# EAGLE design BatteryBoard (EAGLE 9.6.2)
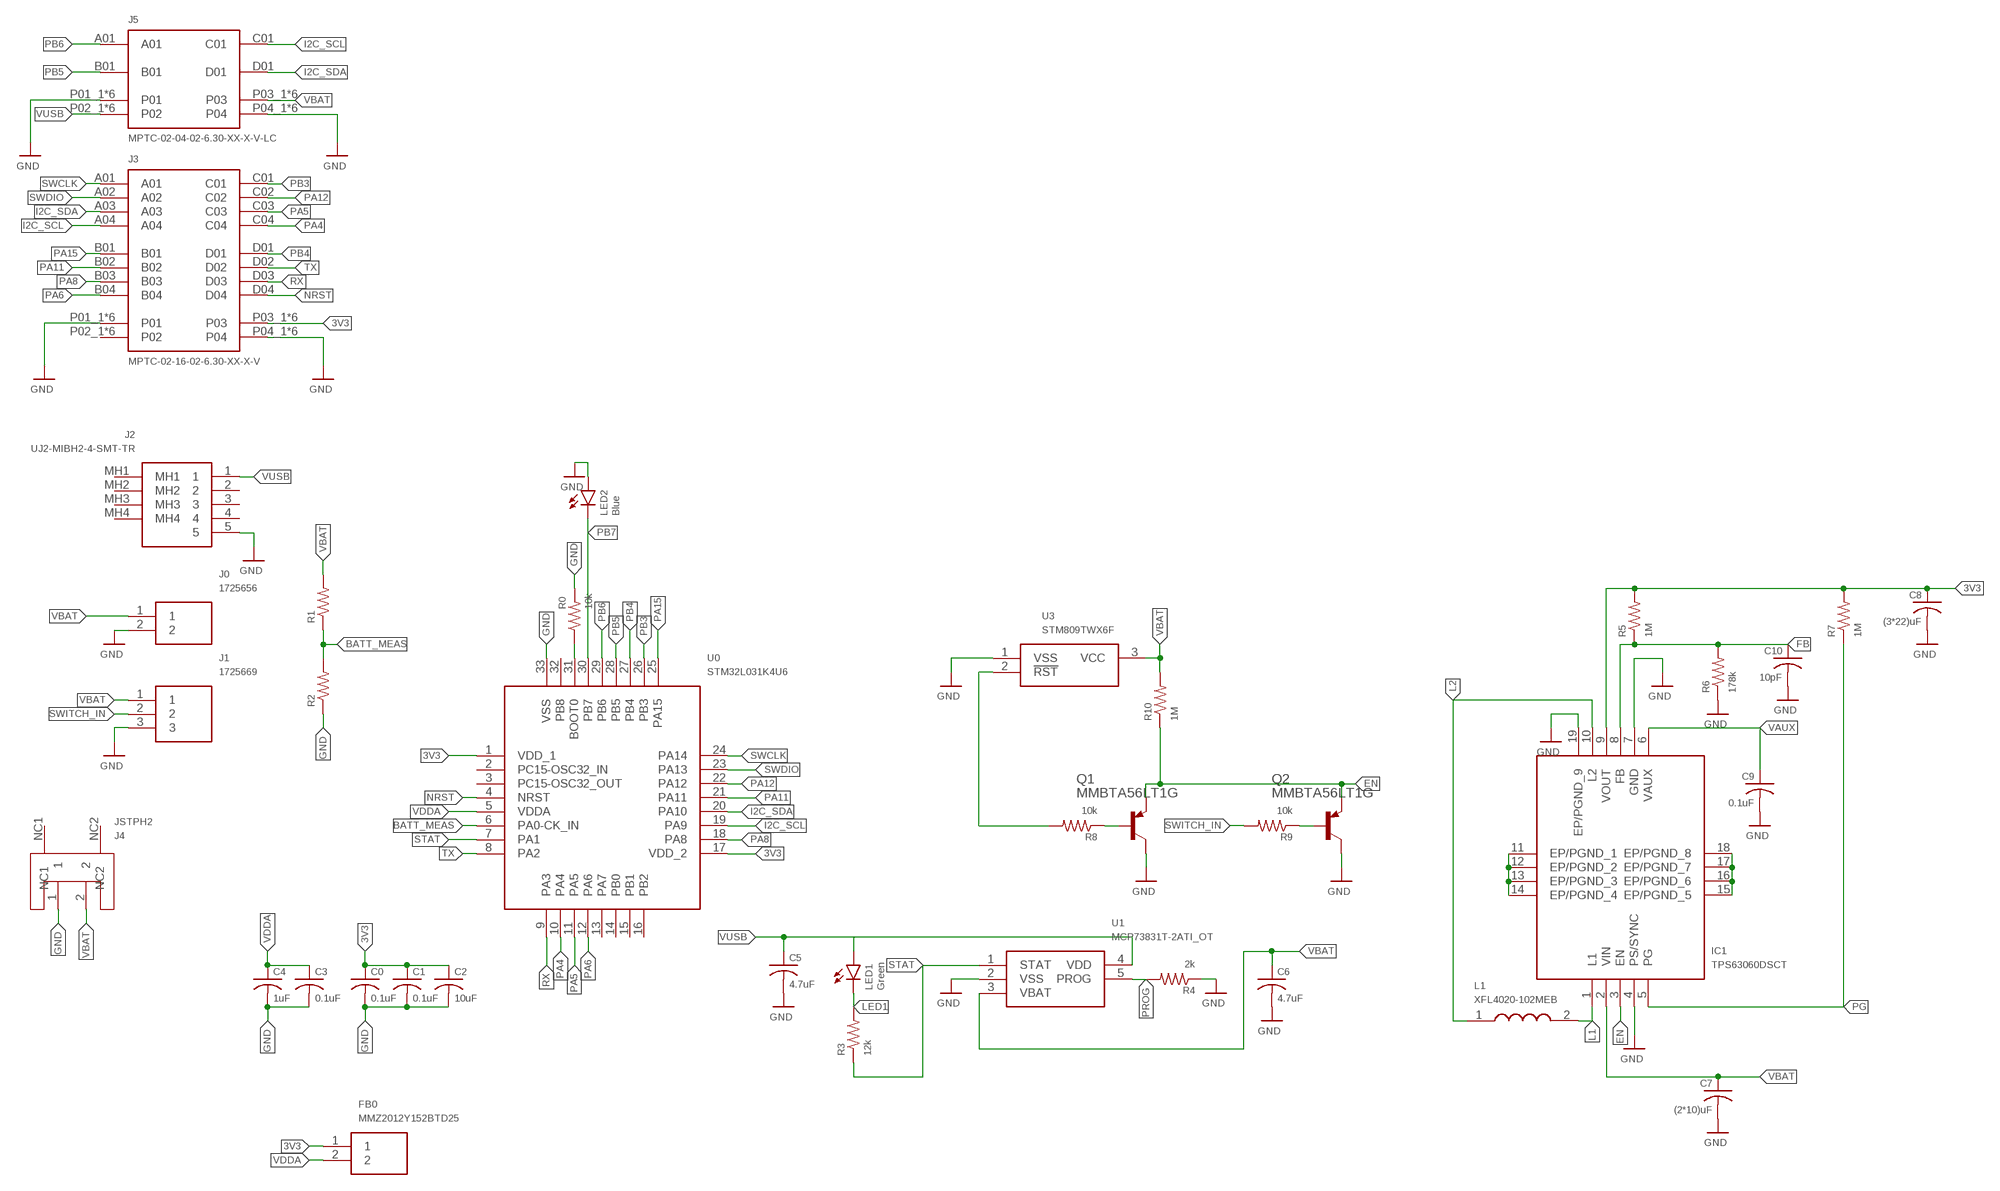
[diagram p0: schematic, sheet 1]

## Parts
C0  0.1uF  C-USC0805  [C0805]
C1  0.1uF  C-USC0805  [C0805]
C2  10uF  C-USC0805  [C0805]
C3  0.1uF  C-USC0805  [C0805]
C4  1uF  C-USC0805  [C0805]
C5  4.7uF  C-USC0805  [C0805]
C6  4.7uF  C-USC0805  [C0805]
C7  (2*10)uF  C-USC0805  [C0805]
C8  (3*22)uF  C-USC0805  [C0805]
C9  0.1uF  C-USC0805  [C0805]
C10  10pF  C-USC0805  [C0805]
FB0  MMZ2012Y152BTD25  [BEADC2012X105N]
IC1  TPS63060DSCT  [TPS63060DSCT]
J0  1725656  [1725656]
J1  1725669  [1725669]
J2  UJ2-MIBH2-4-SMT-TR  [UJ2MIBH24SMTTR]
J3  MPTC-02-16-02-6.30-XX-X-V  [SAMTEC_MPTC-02-16-02-6.30-XX-X-V]
J4  JSTPH2  [JSTPH2]
J5  MPTC-02-04-02-6.30-XX-X-V-LC  [SAMTEC_MPTC-02-04-02-6.30-XX-X-V-LC]
L1  XFL4020-102MEB  [XFL4020102MEB]
LED1  Green  LEDCHIP-LED0805  [CHIP-LED0805]
LED2  Blue  LEDCHIP-LED0805  [CHIP-LED0805]
Q1  MMBTA56LT1G  BC807-16-PNP-SOT23-BEC  [SOT23-BEC]
Q2  MMBTA56LT1G  BC807-16-PNP-SOT23-BEC  [SOT23-BEC]
R0  10k  R-US_R0805  [R0805]
R1  R-US_R0805  [R0805]
R2  R-US_R0805  [R0805]
R3  12k  R-US_R0805  [R0805]
R4  2k  R-US_R0805  [R0805]
R5  1M  R-US_R0805  [R0805]
R6  178k  R-US_R0805  [R0805]
R7  1M  R-US_R0805  [R0805]
R8  10k  R-US_R0805  [R0805]
R9  10k  R-US_R0805  [R0805]
R10  1M  R-US_R0805  [R0805]
U0  STM32L031K4U6  [QFN50P500X500X60-33N]
U1  MCP73831T-2ATI_OT  [SOT95P270X145-5N]
U3  STM809TWX6F  [SOT103P237X112-3N]

## Nets
3V3: C0.1 C1.1 C2.1 C8.1 FB0.1 IC1.9(VOUT) J3.P03_1(P03) J3.P03_2(P03) J3.P03_3(P03) J3.P03_4(P03) J3.P03_5(P03) J3.P03_6(P03) R5.2 R7.2 U0.1(VDD_1) U0.17(VDD_2)
BATT_MEAS: R1.1 R2.2 U0.6(PA0-CK_IN)
BOOT0: R0.1 U0.31(BOOT0)
EN: IC1.3(EN) Q1.E Q2.E R10.1
FB: C10.1 IC1.8(FB) R5.1 R6.2
GND: C0.2 C1.2 C2.2 C3.2 C4.2 C5.2 C6.2 C7.2 C8.2 C9.2 C10.2 IC1.4(PS/SYNC) IC1.7(GND) IC1.11(EP/PGND_1) IC1.12(EP/PGND_2) IC1.13(EP/PGND_3) IC1.14(EP/PGND_4) IC1.15(EP/PGND_5) IC1.16(EP/PGND_6) IC1.17(EP/PGND_7) IC1.18(EP/PGND_8) IC1.19(EP/PGND_9) J0.2 J1.3 J2.5 J3.P01_1(P01) J3.P01_2(P01) J3.P01_3(P01) J3.P01_4(P01) J3.P01_5(P01) J3.P01_6(P01) J3.P04_1(P04) J3.P04_2(P04) J3.P04_3(P04) J3.P04_4(P04) J3.P04_5(P04) J3.P04_6(P04) J4.1 J5.P01_1(P01) J5.P01_2(P01) J5.P01_3(P01) J5.P01_4(P01) J5.P01_5(P01) J5.P01_6(P01) J5.P04_1(P04) J5.P04_2(P04) J5.P04_3(P04) J5.P04_4(P04) J5.P04_5(P04) J5.P04_6(P04) LED2.A Q1.C Q2.C R0.2 R2.1 R4.1 R6.1 U0.33(VSS) U1.2(VSS) U3.1(VSS)
I2C_SCL: J3.A04 J5.C01 U0.19(PA9)
I2C_SDA: J3.A03 J5.D01 U0.20(PA10)
L1: IC1.1(L1) L1.2
L2: IC1.10(L2) L1.1
LED1: LED1.C R3.2
N$2: Q1.B R8.1
N$4: Q2.B R9.1
NRST: J3.D04 U0.4(NRST)
PA4: J3.C04 U0.10(PA4)
PA5: J3.C03 U0.11(PA5)
PA6: J3.B04 U0.12(PA6)
PA8: J3.B03 U0.18(PA8)
PA11: J3.B02 U0.21(PA11)
PA12: J3.C02 U0.22(PA12)
PA15: J3.B01 U0.25(PA15)
PB3: J3.C01 U0.26(PB3)
PB4: J3.D01 U0.27(PB4)
PB5: J5.B01 U0.28(PB5)
PB6: J5.A01 U0.29(PB6)
PB7: LED2.C U0.30(PB7)
PG: IC1.5(PG) R7.1
PROG: R4.2 U1.5(PROG)
PROTECTION_NRST: R8.2 U3.2(!RST)
RX: J3.D03 U0.9(PA3)
STAT: R3.1 U0.7(PA1) U1.1(STAT)
SWCLK: J3.A01 U0.24(PA14)
SWDIO: J3.A02 U0.23(PA13)
SWITCH_IN: J1.2 R9.2
TX: J3.D02 U0.8(PA2)
VAUX: C9.1 IC1.6(VAUX)
VBAT: C6.1 C7.1 IC1.2(VIN) J0.1 J1.1 J4.2 J5.P03_1(P03) J5.P03_2(P03) J5.P03_3(P03) J5.P03_4(P03) J5.P03_5(P03) J5.P03_6(P03) R1.2 R10.2 U1.3(VBAT) U3.3(VCC)
VDDA: C3.1 C4.1 FB0.2 U0.5(VDDA)
VUSB: C5.1 J2.1 J5.P02_1(P02) J5.P02_2(P02) J5.P02_3(P02) J5.P02_4(P02) J5.P02_5(P02) J5.P02_6(P02) LED1.A U1.4(VDD)
Unconnected: J2.2 J2.3 J2.4 J2.MH1 J2.MH2 J2.MH3 J2.MH4 J4.NC1 J4.NC2 U0.2(PC15-OSC32_IN) U0.3(PC15-OSC32_OUT) U0.13(PA7) U0.14(PB0) U0.15(PB1) U0.16(PB2) U0.32(PB8)

## Power pins joined to a net without a drawn wire
P02: J3.P02_1(P02) J3.P02_2(P02) J3.P02_3(P02) J3.P02_4(P02) J3.P02_5(P02) J3.P02_6(P02)

## Library data of the parts
C0 C1-C10 = rcl:C-US: CAPACITOR, American symbol; SPICEPREFIX: C
FB0 = SamacSys_Parts:MMZ2012Y152BTD25: Ferrite Beads 0805 1500ohms 500mA Signal Line AEC-Q200 Source: Datasheet <https://product.tdk.com/info/en/catalog/datasheets/beads_automotive_signal_mmz2012_en.pdf>; DESCRIPTION: Ferrite Beads 0805 1500ohms 500mA Signal Line AEC-Q200; HEIGHT: 1.05mm; MANUFACTURER_NAME: TDK; MANUFACTURER_PART_NUMBER: MMZ2012Y152BTD25; MOUSER_PART_NUMBER: 810-MMZ2012Y152BTD25; MOUSER_PRICE-STOCK: https://www.mouser.co.uk/ProductDetail/TDK/MMZ2012Y152BTD25/?qs=z4cHi%252BdwYubbRRUCER1uug%3D%3D
IC1 = SamacSys_Parts:TPS63060DSCT: Switching Voltage Regulators 2.5-12Vin,2.25A Sw Crnt Limit Source: Datasheet <https://www.ti.com/lit/ds/symlink/tps63060.pdf?ts=1601363493602&ref_url=https%3A%2F%2Fwww.ti.com%2Fproduct%2FTPS63060>; DESCRIPTION: Switching Voltage Regulators 2.5-12Vin,2.25A Sw Crnt Limit; HEIGHT: 0.8mm; MANUFACTURER_NAME: Texas Instruments; MANUFACTURER_PART_NUMBER: TPS63060DSCT; MOUSER_PART_NUMBER: 595-TPS63060DSCT; MOUSER_PRICE-STOCK: https://www.mouser.co.uk/ProductDetail/Texas-Instruments/TPS63060DSCT/?qs=3jfYfyvUSwDkzbf98IOP5g%3D%3D
J0 = SamacSys_Parts:1725656: 2 way PCB vertical mount terminal,2.54mm 2 way PCB vertical mount terminal,2.54mm Source: Datasheet <https://www.phoenixcontact.com/online/portal/gb?uri=pxc-oc-itemdetail:pid=1725656&library=gben&tab=1>; DESCRIPTION: 2 way PCB vertical mount terminal,2.54mm 2 way PCB vertical mount terminal,2.54mm; HEIGHT: 8mm; MANUFACTURER_NAME: Phoenix Contact; MANUFACTURER_PART_NUMBER: 1725656; MOUSER_PART_NUMBER: 651-1725656; MOUSER_PRICE-STOCK: https://www.mouser.co.uk/ProductDetail/Phoenix-Contact/1725656/?qs=Ul7CXFMnlWWQeccayYbRmw%3D%3D
J1 = SamacSys_Parts:1725669: 3 way PCB vertical mount terminal,2.54mm 3 way PCB vertical mount terminal,2.54mm Source: Datasheet <https://www.phoenixcontact.com/online/portal/gb?uri=pxc-oc-itemdetail:pid=1725669&library=gben&tab=1>; DESCRIPTION: 3 way PCB vertical mount terminal,2.54mm 3 way PCB vertical mount terminal,2.54mm; HEIGHT: 8.5mm; MANUFACTURER_NAME: Phoenix Contact; MANUFACTURER_PART_NUMBER: 1725669; MOUSER_PART_NUMBER: 651-1725669; MOUSER_PRICE-STOCK: https://www.mouser.co.uk/ProductDetail/Phoenix-Contact/1725669/?qs=A%2FKWGUWTCZjmkTL0Oe91ew%3D%3D
J2 = SamacSys_Parts:UJ2-MIBH2-4-SMT-TR: CONN RCPT USB2.0 MICRO B SMD R/A Source: Datasheet <https://www.cui.com/product/resource/digikeypdf/uj2-mibh2-4-smt.pdf>; DESCRIPTION: CONN RCPT USB2.0 MICRO B SMD R/A; HEIGHT: 2.5mm; MANUFACTURER_NAME: CUI Inc.; MANUFACTURER_PART_NUMBER: UJ2-MIBH2-4-SMT-TR; MOUSER_PART_NUMBER: 490-UJ2-MIBH2-4-SMT; MOUSER_PRICE-STOCK: https://www.mouser.co.uk/ProductDetail/CUI-Devices/UJ2-MIBH2-4-SMT-TR/?qs=5mqXD9RfOg1yxHIpPvPxvQ%3D%3D
J3 = MPTC-02-16-02-6.30-XX-X-V:MPTC-02-16-02-6.30-XX-X-V: 30 A SIGNAL/POWER COMBO SYSTEM; MANUFACTURER: Samtec; MAXIMUM_PACKAGE_HEIGHT: 11.38 mm; PARTREV: L; STANDARD: Manufacturer Recommendations
J4 = Connect:JSTPH2
J5 = MPTC-02-04-02-6.30-XX-X-V-LC:MPTC-02-04-02-6.30-XX-X-V-LC: DC Power Connectors; MANUFACTURER: Samtec; MAXIMUM_PACKAGE_HEIGHT: 11.38 mm; PARTREV: L; STANDARD: Manufacturer Recommendations
L1 = SamacSys_Parts:XFL4020-102MEB: 1 ELEMENT, 1 uH, METAL COMPOSITE-CORE, GENERAL PURPOSE INDUCTOR, SMD Source: Datasheet <https://www.coilcraft.com/getmedia/50632d43-da1b-4cdb-8ab4-3029cab51df3/xfl4020.pdf>; DESCRIPTION: 1 ELEMENT, 1 uH, METAL COMPOSITE-CORE, GENERAL PURPOSE INDUCTOR, SMD; HEIGHT: 2.1mm; MANUFACTURER_NAME: COILCRAFT; MANUFACTURER_PART_NUMBER: XFL4020-102MEB; MOUSER_PART_NUMBER: 994-XFL4020-102MEB; MOUSER_PRICE-STOCK: https://www.mouser.co.uk/ProductDetail/Coilcraft/XFL4020-102MEB/?qs=VJjuEbE9QBMkuCkoKl%252B%2FQw%3D%3D
LED1 LED2 = led:LED: LED OSRAM: - CHIPLED LG R971, LG N971, LY N971, LG Q971, LY Q971, LO R971, LY R971 LH N974, LH R974 LS Q976, LO Q976, LY Q976 LO Q996 - Hyper CHIPLED LW Q18S LB Q993, LB Q99A, LB R99A - SideLED LS A670, LO A670, LY A670, LG A670, LP A670 LB A673, LV A673, LT A673, LW A673 LH A674 LY A675 LS A676, LA A676, LO A676, LY A676, LW A676 LS A679, LY A679, LG A679 - Hyper Micro SIDELED® LS Y876, LA Y876, LO Y876, LY Y876 LT Y87S - SmartLED LW L88C, LW L88S LB L89C, LB L89S, LG L890 LS L89K, LO L89K, LY L89K LS L896, LA L896, LO L896, LY L896 - TOPLED LS T670, LO T670, LY T670, LG T670, LP T670 LSG T670, LSP T670, LSY T670, LOP T670, LYG T670 LG T671, LOG T671, LSG T671 LB T673, LV T673, LT T673, LW T673 LH T674 LS T676, LA T676, LO T676, LY T676, LB T676, LH T676, LSB T676, LW T676 LB T67C, LV T67C, LT T67C, LS T67K, LO T67K, LY T67K, LW E67C LS E67B, LA E67B, LO E67B, LY E67B, LB E67C, LV E67C, LT E67C LW T67C LS T679, LY T679, LG T679 LS T770, LO T770, LY T770, LG T770, LP T770 LB T773, LV T773, LT T773, LW T773 LH T774 LS E675, LA E675, LY E675, LS T675 LS T776, LA T776, LO T776, LY T776, LB T776 LHGB T686 LT T68C, LB T68C - Hyper Mini TOPLED® LB M676 - Mini TOPLED Santana® LG M470 LS M47K, LO M47K, LY M47K Source: http://www.osram.convergy.de LUXEON: - LUMILED® LXK2-PW12-R00, LXK2-PW12-S00, LXK2-PW14-U00, LXK2-PW14-V00 LXK2-PM12-R00, LXK2-PM12-S00, LXK2-PM14-U00 LXK2-PE12-Q00, LXK2-PE12-R00, LXK2-PE12-S00, LXK2-PE14-T00, LXK2-PE14-U00 LXK2-PB12-K00, LXK2-PB12-L00, LXK2-PB12-M00, LXK2-PB14-N00, LXK2-PB14-P00, LXK2-PB14-Q00 LXK2-PR12-L00, LXK2-PR12-M00, LXK2-PR14-Q00, LXK2-PR14-R00 LXK2-PD12-Q00, LXK2-PD12-R00, LXK2-PD12-S00 LXK2-PH12-R00, LXK2-PH12-S00 LXK2-PL12-P00, LXK2-PL12-Q00, LXK2-PL12-R00 Source: www.luxeon.com KINGBRIGHT: KA-3528ASYC Source: www.kingbright.com
Q1 Q2 = transistor:*-PNP-: PNP Transistror
R0 R1-R10 = rcl:R-US_: RESISTOR, American symbol; SPICEPREFIX: R
U0 = SamacSys_Parts:STM32L031K4U6: ARM Microcontrollers - MCU 16/32-BITS MICROS Source: Datasheet <https://componentsearchengine.com/Datasheets/1/STM32L031K4U6.pdf>; DESCRIPTION: ARM Microcontrollers - MCU 16/32-BITS MICROS; HEIGHT: 0.6mm; MANUFACTURER_NAME: STMicroelectronics; MANUFACTURER_PART_NUMBER: STM32L031K4U6; MOUSER_PART_NUMBER: 511-STM32L031K4U6; MOUSER_PRICE-STOCK: https://www.mouser.com/Search/Refine.aspx?Keyword=511-STM32L031K4U6
U1 = SamacSys_Parts:MCP73831T-2ATI_OT: Microchip MCP73831T-2ATI/OT, Battery Charge Controller Lithium-Ion/Polymer, 500mA, 5-pin SOT-23 Source: Datasheet; DESCRIPTION: Microchip MCP73831T-2ATI/OT, Battery Charge Controller Lithium-Ion/Polymer, 500mA, 5-pin SOT-23; HEIGHT: 1.45mm; MANUFACTURER_NAME: Microchip; MANUFACTURER_PART_NUMBER: MCP73831T-2ATI/OT; MOUSER_PART_NUMBER: 579-MCP73831T-2ATIOT; MOUSER_PRICE-STOCK: https://www.mouser.co.uk/ProductDetail/Microchip-Technology/MCP73831T-2ATI-OT?qs=yUQqVecv4qsZbioEUu%252B83g%3D%3D
U3 = SamacSys_Parts:STM809TWX6F: STM809TWX6F, Processor Supervisor 3 V, 3.3 V, 5 V Active Low, Push-Pull, 3-Pin SOT-23 Source: Datasheet <http://www.st.com/web/en/resource/technical/document/datasheet/CD00003591.pdf>; DESCRIPTION: STM809TWX6F, Processor Supervisor 3 V, 3.3 V, 5 V Active Low, Push-Pull, 3-Pin SOT-23; HEIGHT: 1.12mm; MANUFACTURER_NAME: STMicroelectronics; MANUFACTURER_PART_NUMBER: STM809TWX6F; MOUSER_PART_NUMBER: 511-STM809TWX6F; MOUSER_PRICE-STOCK: https://www.mouser.co.uk/ProductDetail/STMicroelectronics/STM809TWX6F?qs=sps7W%2FwBcGF1WRYECktBGw%3D%3D

## Board
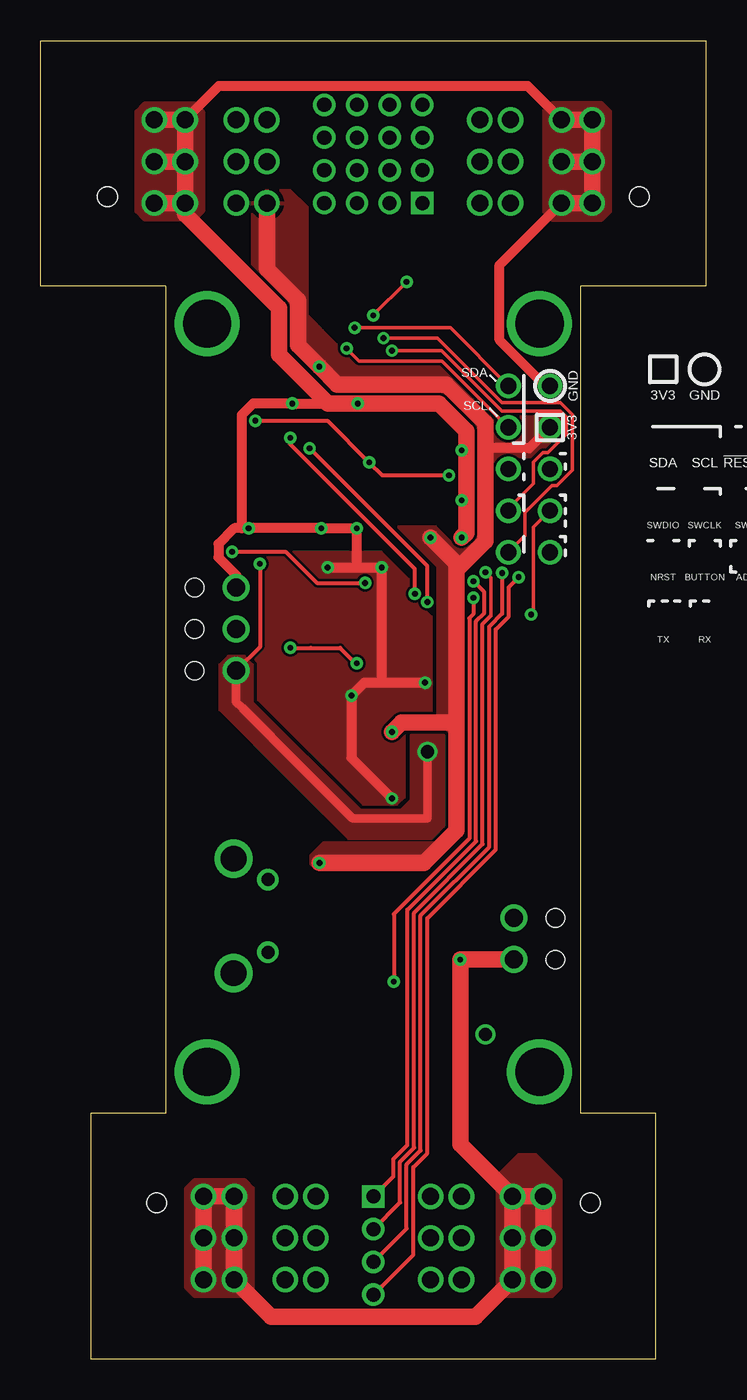
[diagram p1: board, top side]
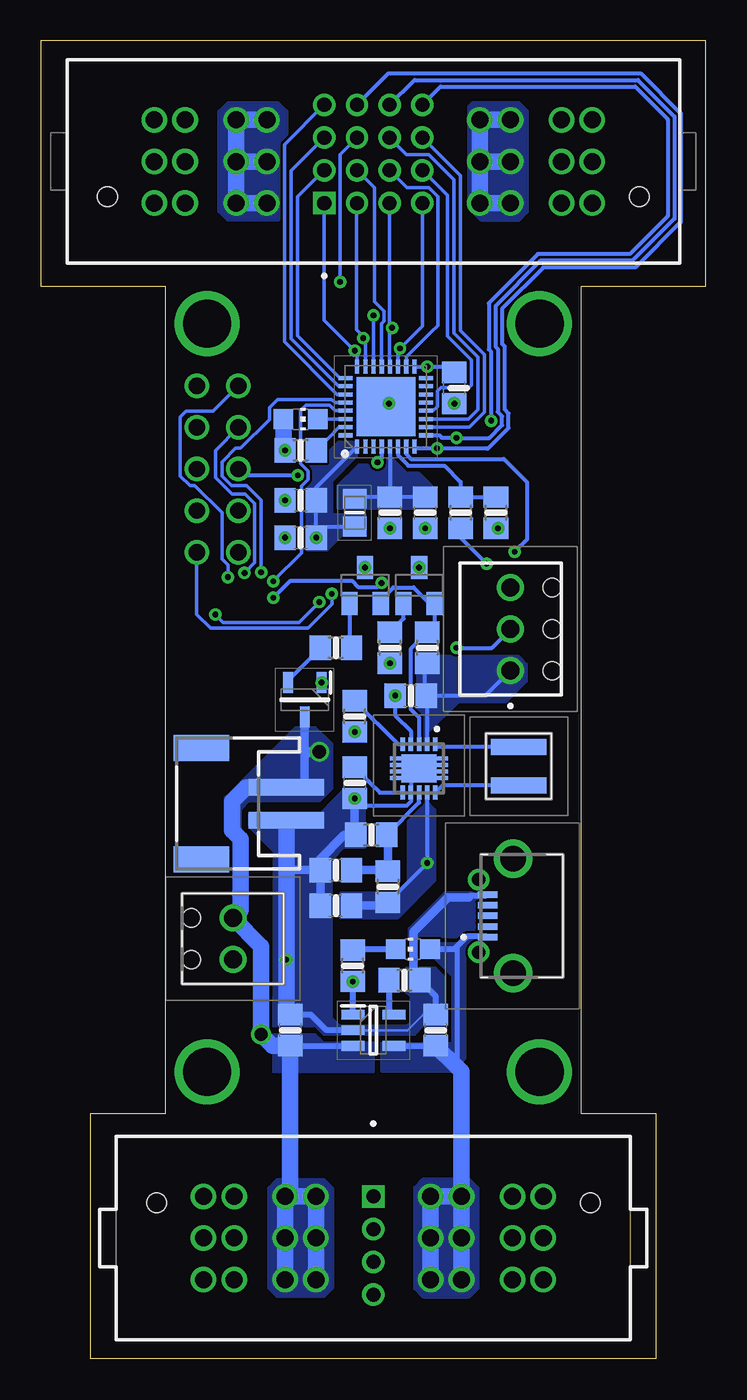
[diagram p2: board, bottom side, seen from below]

Size 40.64 x 80.52 mm. Coordinates in mm from the lower left corner, seen from the top.
Outline: 33.02,14.99 33.02,65.53 40.64,65.53 40.64,80.52 0,80.52 0,65.53 7.62,65.53 7.62,14.99 3.05,14.99 3.05,0 37.59,0 37.59,14.99 33.02,14.99
Copper layers (1*16): Top 0.035mm / dielectric 1.5mm / Bottom 0.035mm
Design rules "default *": minimum track width 6mil, minimum drill 0.35mm, track to track 6mil, track to pad 6mil, pad to pad 6mil, via to via 6mil, smd to smd 6mil, copper to edge 10mil, drill to drill 5mil, minimum pad ring 10mil, minimum via ring 8mil, stop-mask expansion 4mil, vias tented up to drill 0mil, thermal gap 10mil

### Footprints (pad centres in the part's own frame; a part is rotated, then mirrored left to right if it is on the bottom)
C0805 = smd 1.3 x 1.5: 1 -0.95,0; 2 0.95,0
BEADC2012X105N = smd 1.2 x 1.45: 1 -0.85,0; 2 0.85,0
TPS63060DSCT = smd 0.28 x 0.85: 1 -1,-1.475; 2 -0.5,-1.475; 3 0,-1.475; 4 0.5,-1.475; 5 1,-1.475; 6 1,1.475; 7 0.5,1.475; 8 0,1.475; 9 -0.5,1.475; 10 -1,1.475 | smd 0.7 x 0.25: 11 -1.425,0.6; 12 -1.425,0.2; 13 -1.425,-0.2; 14 -1.425,-0.6; 15 1.425,-0.6; 16 1.425,-0.2; 17 1.425,0.2; 18 1.425,0.6 | smd 2.15 x 1.7: 19 0,0
1725656 = drill 1.1 pad 1.65: 1 -1.27,3.1; 2 1.27,3.1 | hole 1.1: -1.27,0.56; 1.27,0.56
1725669 = drill 1.1 pad 1.65: 1 0,0; 2 2.54,0; 3 5.08,0 | hole 1.1: 0,-2.54; 2.54,-2.54; 5.08,-2.54
UJ2MIBH24SMTTR = smd 1.2 x 0.4: 1 2.025,1.3; 2 2.025,0.65; 3 2.025,0; 4 2.025,-0.65; 5 2.025,-1.3 | drill 0.8 pad 1.2: MH1 2.575,2.225; MH2 2.575,-2.225 | drill 1.565 pad 2.348: MH3 0.475,-3.5; MH4 0.475,3.5
SAMTEC_MPTC-02-16-02-6.30-XX-X-V = drill 0.86 square: A01 -3,-2.54 | drill 0.86: A02 -1,-2.54; A03 1,-2.54; A04 3,-2.54; B01 -3,-0.54; B02 -1,-0.54; B03 1,-0.54; B04 3,-0.54; C01 -3,1.46; C02 -1,1.46; C03 1,1.46; C04 3,1.46; D01 -3,3.46; D02 -1,3.46; D03 1,3.46; D04 3,3.46 | drill 1.04: P01_1 -13.385,-2.54; P01_2 -13.385,0; P01_3 -13.385,2.54; P01_4 -11.505,-2.54; P01_5 -11.505,0; P01_6 -11.505,2.54; P02_1 -8.385,-2.54; P02_2 -8.385,0; P02_3 -8.385,2.54; P02_4 -6.505,-2.54; P02_5 -6.505,0; P02_6 -6.505,2.54; P03_1 6.505,-2.54; P03_2 6.505,0; P03_3 6.505,2.54; P03_4 8.385,-2.54; P03_5 8.385,0; P03_6 8.385,2.54; P04_1 11.505,-2.54; P04_2 11.505,0; P04_3 11.505,2.54; P04_4 13.385,-2.54; P04_5 13.385,0; P04_6 13.385,2.54 | hole 1.19: -16.255,-2.15; 16.255,-2.15
JSTPH2 = smd 1 x 4.6: 1 -1,-3.7; 2 1,-3.7 | smd 1.6 x 3.4: NC1 -3.4,1.5; NC2 3.4,1.5
SAMTEC_MPTC-02-04-02-6.30-XX-X-V-LC = drill 0.86 square: A01 0,-2.54 | drill 0.86: B01 0,-0.54; C01 0,1.46; D01 0,3.46 | drill 1.04: P01_1 -10.385,-2.54; P01_2 -10.385,0; P01_3 -10.385,2.54; P01_4 -8.505,-2.54; P01_5 -8.505,0; P01_6 -8.505,2.54; P02_1 -5.385,-2.54; P02_2 -5.385,0; P02_3 -5.385,2.54; P02_4 -3.505,-2.54; P02_5 -3.505,0; P02_6 -3.505,2.54; P03_1 3.505,-2.54; P03_2 3.505,0; P03_3 3.505,2.54; P03_4 5.385,-2.54; P03_5 5.385,0; P03_6 5.385,2.54; P04_1 8.505,-2.54; P04_2 8.505,0; P04_3 8.505,2.54; P04_4 10.385,-2.54; P04_5 10.385,0; P04_6 10.385,2.54 | hole 1.19: -13.255,-2.15; 13.255,-2.15
XFL4020102MEB = smd 0.98 x 3.4: 1 -1.185,0; 2 1.185,0
CHIP-LED0805 = smd 1.2 x 1.2: A 0,-1.05; C 0,1.05
SOT23-BEC = smd 1 x 1.4: B -0.95,-1.1; C 0,1.1; E 0.95,-1.1
R0805 = smd 1.3 x 1.5: 1 -0.95,0; 2 0.95,0
QFN50P500X500X60-33N = smd 0.85 x 0.25: 1 -2.45,1.75; 2 -2.45,1.25; 3 -2.45,0.75; 4 -2.45,0.25; 5 -2.45,-0.25; 6 -2.45,-0.75; 7 -2.45,-1.25; 8 -2.45,-1.75; 17 2.45,-1.75; 18 2.45,-1.25; 19 2.45,-0.75; 20 2.45,-0.25; 21 2.45,0.25; 22 2.45,0.75; 23 2.45,1.25; 24 2.45,1.75 | smd 0.25 x 0.85: 9 -1.75,-2.45; 10 -1.25,-2.45; 11 -0.75,-2.45; 12 -0.25,-2.45; 13 0.25,-2.45; 14 0.75,-2.45; 15 1.25,-2.45; 16 1.75,-2.45; 25 1.75,2.45; 26 1.25,2.45; 27 0.75,2.45; 28 0.25,2.45; 29 -0.25,2.45; 30 -0.75,2.45; 31 -1.25,2.45; 32 -1.75,2.45 | smd 3.6 x 3.6: 33 0,0
SOT95P270X145-5N = smd 1.4 x 0.6: 1 -1.25,0.95; 2 -1.25,0; 3 -1.25,-0.95; 4 1.25,-0.95; 5 1.25,0.95
SOT103P237X112-3N = smd 1.3 x 0.6: 1 -1.05,1.03; 2 -1.05,-1.03; 3 1.05,0

### Placement (x,y rotation side)
C0  24.77,52.45 180 bottom
C1  15.37,59.31 270 bottom
C2  24.77,50.17 180 bottom
C3  17.14,51.69 270 bottom
C4  19.3,51.69 270 bottom
C5  16.51,20.07 90 bottom
C6  25.4,20.07 90 bottom
C7  18.03,40.51 180 bottom
C8  22.61,27.69 180 bottom
C9  21.46,35.18 270 bottom
C10  22.61,29.85 180 bottom
FB0  21.46,51.69 90 bottom
IC1  17.53,36.07 180 bottom
J0  32,25.65 270 bottom
J1  11.94,42.04 90 bottom
J2  11.3,27.05 180 bottom
J3  20.32,73.15 0 bottom
J4  29.34,33.91 90 bottom
J5  20.32,7.37 180 bottom
L1  11.43,36.2 90 bottom
LED1  17.91,25.02 90 bottom
LED2  24.77,57.4 270 bottom
Q1  20.83,47.24 0 bottom
Q2  17.53,47.24 0 bottom
R0  24.77,55.5 180 bottom
R1  14.99,51.69 270 bottom
R2  12.83,51.69 90 bottom
R3  21.59,24 90 bottom
R4  18.41,23.11 180 bottom
R5  19.43,28.83 270 bottom
R6  20.45,32 0 bottom
R7  21.46,39.24 270 bottom
R8  22.61,43.43 180 bottom
R9  19.3,43.43 270 bottom
R10  17.02,43.43 270 bottom
U0  19.56,58.17 90 bottom
U1  20.32,20.07 0 bottom
U3  24.51,40.26 270 bottom

### Tracks (layer width: path | path; a pad name or v marks a point on that pad's centre or on a via)
3V3  (via drill 0.35, 1)
  Top 0.61: v31.12,56.9 29.84,55.63 27.16,55.63
  Top 1.016: 25.4,38.86 25.4,32.26 23.43,30.28 v17.03,30.28 | R7.2 22.03,38.86 25.4,38.86 | 25.4,38.86 25.4,48.18 | 25.4,48.18 27.16,49.95 27.16,55.63 27.16,57.16 24.8,59.53 18.11,59.53 v17.02,60.62 15.72,61.92 15.72,64.68 13.82,66.58 J3.P03_1 | C2.1 25.4,48.58 25.4,48.18
  Bottom 0.254: R5.2 v17.03,30.28 IC1.9 | U0.17 v17.02,60.62 15.72,60.62 C1.1 | U0.1 23.82,53.21 C0.1 C2.1 23.14,50.84 FB0.1
  Bottom 0.508: C8.1 19.62,27.69 R5.2
  Bottom 1.016: J3.P03_4 J3.P03_1 J3.P03_2 | J3.P03_2 J3.P03_5 | J3.P03_2 J3.P03_3 J3.P03_6
  other vias: 21.46,38.29 23.82,50.17
  pour Bottom (no thermals): 22.35,28.45 22.35,26.92 18.8,26.92 16.51,29.21 16.51,33.27 16.51,33.53 16.94,33.96 16.94,34.52 17.12,34.52 17.12,33.96 17.22,33.86 18.24,32.84 18.24,29.01 18.8,28.45
  pour Bottom (no thermals): 10.92,70.1 10.92,76.2 11.43,76.71 14.22,76.71 14.48,76.45 14.48,70.36 13.72,69.6 11.68,69.6 11.43,69.6
  pour Bottom (no thermals): 21.34,56.01 22.48,56.01 23.11,55.37 23.88,55.37 24.38,54.86 24.38,52.32 22.86,52.32 22.86,53.59 21.34,55.12
  pour Bottom (no thermals): 24.38,52.32 24.38,49.4 23.11,49.4 22.23,50.29 20.83,50.29 20.83,51.56 22.86,51.56 22.86,52.32
  pour Top: 24.26,38.99 24.26,48.39 21.84,50.8 24.13,50.8 25.15,49.78 25.91,49.78 26.42,50.29 27.43,50.29 25.4,48.26 25.4,32 23.37,29.97 16.76,29.97 16.51,30.23 16.51,30.73 17.27,31.5 24.13,31.5 25.08,32.45 25.08,38.16
  pour Top: 27.69,54.86 27.94,55.12 29.97,55.12 30.23,55.37 30.99,55.37 32,56.39 32,57.15 32,57.4 31.75,57.66 28.19,57.66 27.43,57.66 27.18,57.91 24.38,60.71 24.13,60.71 19.3,60.71 17.53,62.48 16.26,63.75 16.26,70.36 15.24,71.37 13.46,71.37 12.95,70.87 12.95,70.1 12.95,66.8 13.46,66.29 15.24,64.52 15.24,62.23 15.24,61.98 18.03,59.18 18.29,58.93 24.64,58.93 26.67,56.9 26.67,50.55 25.91,49.78 26.42,49.28 27.18,50.04 27.18,51.82 27.18,54.36
BATT_MEAS
  Bottom 0.254: R2.2 R1.1 14.99,53.56 15.99,54.56 18.17,54.56 18.81,55.2 U0.6
BOOT0
  Bottom 0.203: R0.1 22.69,56.63 22.69,56.65 22.42,56.92 22.14,56.92
  Bottom 0.254: 22.14,56.92 U0.31
EN
  Bottom 0.254: Q1.E 19.88,46.34 19.09,47.12 17.86,47.12 16.88,46.14 Q2.E 16.58,44.83 R10.1 18.05,43.36 18.05,39.68 17.53,39.16 IC1.3
FB
  Bottom 0.254: R6.2 17.53,33.98 IC1.8
  Bottom 0.508: C10.1 19.5,29.85 R5.1 19.43,31.94 R6.2
GND  (via drill 0.35, 1)
  Top 0.203: 26,52.32 25.87,52.45 v25.71,52.45
  Top 0.61: 19.3,48.34 Q1.C 20.83,41.31 | 20.83,41.31 19.78,41.31 C7.2 18.98,36.71 C9.2 | 20.83,41.31 U3.1 | 12.28,50.74 v12.7,50.74 C3.2 C4.2 19.3,48.34 | 12.28,50.74 11.81,50.74 10.85,49.78 10.85,48.96 11.94,47.87 J1.3 | 12.28,50.74 12.28,57.66 12.98,58.36 C1.2 17.54,58.36 | v31.12,59.44 30.84,59.44 28.04,62.24 28.04,66.83 J3.P01_4 | J3.P01_6 29.76,77.75 10.88,77.75 J3.P04_3 | Q2.C 19.3,48.34 | 26,55.37 25.87,55.5 v25.71,55.5
  Top 1.016: J3.P04_1 8.81,69.93 14.55,64.19 14.55,61.35 17.54,58.36 v19.37,58.36 24.32,58.36 26,56.68 26,55.37 26,52.32 26,50.45 v25.71,50.17 | J3.P04_5 J3.P04_2 | J3.P04_2 J3.P04_1 | J3.P04_2 J3.P04_3 J3.P04_6 | J3.P04_4 J3.P04_1 | J3.P01_4 J3.P01_1 J3.P01_2 | J3.P01_2 J3.P01_5 | J3.P01_2 J3.P01_3 J3.P01_6 | J5.P01_3 J5.P01_2 J5.P01_1 J5.P01_4 J5.P01_5 J5.P01_6 14.08,2.56 26.56,2.56 J5.P04_3 J5.P04_2 J5.P04_1 | J5.P04_1 J5.P04_4 J5.P04_5 J5.P04_6 | J0.2 v25.64,24.38 25.64,13.09 J5.P04_1
  Bottom 0.152: C5.2 17.27,21.02 18.22,20.07 U1.2 | IC1.15 17.53,36.67 IC1.19 17.53,35.87 | IC1.16 17.78,36.27 17.78,36.32 17.78,36.67 IC1.14 | IC1.17 17.53,35.87 | IC1.18 17.53,35.47 | 17.53,35.47 17.53,35.87 | IC1.12 17.65,35.87 17.65,35.94 | IC1.11 17.53,35.47 | IC1.13 17.65,36.27 17.65,36.2
  Bottom 0.203: U0.33 v19.37,58.36
  Bottom 0.254: 17.78,36.32 17.65,36.2 IC1.19 17.65,35.94 18.03,35.57 IC1.7 18.03,34.04 18.29,33.78 21.46,33.78 | C7.2 18.98,39.3 18.03,38.35 IC1.4
  Bottom 0.381: 17.24,22.89 16.51,22.16 C5.2 | C6.2 25.15,21.02 24.13,21.02 23.18,20.07 U1.2 | J2.5 13.39,28.35 13.46,28.28 14.39,28.28 14.48,28.19
  Bottom 0.406: R4.1 17.24,22.89
  Bottom 0.508: C9.2 21.46,33.78 21.46,32.07 R6.1 22.1,32 23.62,30.48 23.62,29.91 C10.2 | C10.2 C8.2 | C10.2 25.26,29.85 25.64,29.46 | R4.1 17.86,23.51 17.86,26.08 15.75,28.19 14.48,28.19
  Bottom 0.61: R2.1 v12.7,50.74 | v25.71,55.5 25.82,55.6
  Bottom 1.016: J4.1 25.64,29.46 v25.64,24.38 25.64,21.12 25.54,21.02 25.15,21.02 | 25.82,55.6 LED2.A
  other vias: 23.48,41.31 18.98,40.51 21.46,34.23 20.83,48.34 19.3,50.74 17.53,48.34 17.14,50.74 15.37,58.36
  pour Bottom (no thermals): 18.29,20.32 22.35,20.32 24.13,22.1 26.42,22.1 26.42,20.32 23.88,20.32 23.37,19.81 17.78,19.81 17.27,20.32 16,20.32 16,23.37 16.51,23.88 18.29,23.88 18.29,22.35 18.03,22.1 18.03,20.57
  pour Bottom (no thermals): 27.94,32.51 26.42,30.99 26.42,20.32 22.86,20.32 22.86,32.77 23.37,33.27 27.94,33.27
  pour Bottom (no thermals): 22.86,30.48 22.1,31.24 20.83,31.24 20.83,34.8 22.1,34.8 24.13,32.77 24.13,30.48
  pour Bottom (no thermals): 15.24,25.78 14.73,26.16 13.97,26.16 13.97,28.5 15.95,28.5 18.19,26.26 18.19,25.83 18.01,25.65 17.65,25.65 17.53,25.78
  pour Top (no thermals): 9.91,70.1 9.4,69.6 6.35,69.6 5.84,70.1 5.84,76.2 6.35,76.71 9.4,76.71 9.91,76.2
  pour Top (no thermals): 30.73,70.1 31.24,69.6 34.29,69.6 34.8,70.1 34.8,76.2 34.29,76.71 31.24,76.71 30.73,76.2
  pour Top (no thermals): 8.89,10.41 9.4,10.92 12.45,10.92 12.95,10.41 12.95,4.57 12.95,4.32 12.45,3.81 9.4,3.81 8.89,4.32
  pour Top (no thermals): 27.94,4.32 27.94,11.18 29.21,12.45 30.23,12.45 31.75,10.92 31.75,4.32 31.24,3.81 28.45,3.81
  pour Top: 13.72,49.28 13.72,43.43 13.05,42.77 13.27,42.55 13.27,40.26 19.68,33.85 21.78,33.85 22.23,34.29 22.23,39.12 23.88,39.12 23.88,45.34 22.48,46.74 22.48,47.62 20.83,49.28
I2C_SCL  (via drill 0.35, 1)
  Top 0.203: v28.58,56.9 24.51,60.96 19.45,60.96 v18.69,61.72
  Top 0.254: J5.C01 22.36,7.95 22.36,11.86 23.22,12.71 23.22,27.08 27.41,31.27 27.41,44.73 28.19,45.52 v28.19,48.01
  Bottom 0.203: U0.19 18.81,61.6 v18.69,61.72 17.6,62.81 17.32,63.09 J3.A04 | v28.58,56.9 29.97,55.5 29.97,53.83 28.96,52.82 28.16,52.82 27.57,52.23 27.57,48.63 v28.19,48.01
I2C_SDA  (via drill 0.35, 1)
  Top 0.203: v19.18,62.99 25.02,62.99 v28.58,59.44
  Top 0.254: J5.D01 22.77,6.35 22.77,11.69 23.62,12.54 23.62,26.91 27.81,31.1 27.81,44.56 28.6,45.35 28.6,47.14 v29.21,47.75
  Bottom 0.203: J3.A03 19.32,62.74 | 19.32,62.74 19.32,60.63 U0.20 | 19.32,62.74 19.18,62.88 v19.18,62.99 | v29.21,47.75 29.21,48.49 29.58,48.86 29.58,51.7 31.23,53.35 31.53,53.35 32.12,53.94 32.12,57.54 31.75,57.91 30.1,57.91 v28.58,59.44
L1
  Bottom 0.254: L1.2 16.36,37.38 IC1.1
L2
  Bottom 0.254: L1.1 16.11,35.01 IC1.10
LED1
  Bottom 0.381: R3.2 21.52,25.02 LED1.C
N$1  (via drill 2.95)
  other vias: 30.48,63.25
N$2
  Bottom 0.254: Q1.B 21.78,43.56 R8.1
N$3  (via drill 2.95)
  other vias: 30.48,17.53
N$4
  Bottom 0.254: R9.1 18.48,45.21 Q2.B
N$11  (via drill 2.95)
  other vias: 10.16,17.53
N$12  (via drill 2.95)
  other vias: 10.16,63.25
NRST  (via drill 0.35, 1)
  Top 0.254: v13.12,57.31 17.52,57.31 v20.07,54.76 20.85,53.98 v24.94,53.98
  Bottom 0.254: J3.D04 16.21,77.72 4.32,77.72 2.33,75.73 2.33,69.81 4.65,67.49 10.27,67.49 13.26,64.49 13.26,61.67 13.12,61.53 v13.12,57.31 | U0.4 19.81,55.02 v20.07,54.76 | v28.58,54.36 28.19,53.98 v24.94,53.98
P02
  Bottom 1.016: J3.P02_4 J3.P02_1 J3.P02_2 | J3.P02_2 J3.P02_5 | J3.P02_2 J3.P02_3 J3.P02_6
  pour Bottom (no thermals): 25.65,70.1 26.16,69.6 29.21,69.6 29.72,70.1 29.72,76.2 29.21,76.71 26.16,76.71 25.65,76.2
PA4
  Bottom 0.203: J3.C04 14.99,72.28 14.99,62.82 13.53,61.36 13.53,57.83 14.44,56.92 U0.10
PA5
  Bottom 0.203: J3.C03 18.28,73.58 16.92,73.58 15.39,72.05 15.39,62.65 13.93,61.19 13.93,58 14.52,57.42 U0.11
PA6
  Bottom 0.203: J3.B04 15.8,71.09 15.8,62.49 14.34,61.03 14.34,59.49 14.5,59.33 16.19,59.33 16.4,59.12 16.4,58.18 16.66,57.92 U0.12
PA8
  Bottom 0.203: U0.18 18.29,60.64 18.29,61.23 16.77,62.75 16.38,63.13 16.38,71 16.93,71.55 18.26,71.55 J3.B03
PA11
  Bottom 0.203: U0.21 19.81,63.25 19.68,63.39 19.68,63.49 19.68,63.5 19.68,64.02 20.26,64.6 20.26,68.58 20.26,71.55 J3.B02
PA12  (via drill 0.35)
  Top 0.203: v20.31,63.75 v22.34,65.79 v22.35,65.79
  Bottom 0.203: J3.C02 22.35,73.58 v22.35,65.79 | U0.22 v20.31,63.75
PA15
  Bottom 0.203: U0.25 22.35,59.92 24.94,62.51 24.94,70.99 J3.B01
PB3
  Bottom 0.203: J3.C01 25.35,72.58 25.35,62.31 22.45,59.42 U0.26
PB4
  Bottom 0.203: J3.D01 25.76,74.18 25.76,62.14 22.53,58.92 U0.27
PB5  (via drill 0.35)
  Top 0.203: v27.18,48.04 27.5,47.72 27.5,45.4
  Top 0.254: J5.B01 21.95,9.54 21.95,12.02 22.81,12.88 22.81,27.25 27,31.44 27,44.9 27.5,45.4
  Bottom 0.203: U0.28 22.66,58.42 22.86,58.61 26.16,58.61 26.67,58.11 26.67,57.38 28.43,55.63 28.73,55.63 29.58,54.77 29.58,53.94 28.98,53.34 28.07,53.34 27.18,52.45 v27.18,48.04
PB6  (via drill 0.35)
  Top 0.254: J5.A01 21.55,11.13 21.55,12.19 22.4,13.05 22.4,27.42 26.59,31.61 26.59,45.07 27.1,45.57 27.1,46.84 v26.44,47.5
  Bottom 0.203: U0.29 22.67,57.92 23.01,58.26 24.42,58.26 24.77,57.91 24.77,54.69 24.31,54.24 24.31,53.71 24.72,53.31 24.72,49.22 v26.44,47.5
PB7
  Bottom 0.203: U0.30 23.7,57.42 LED2.C
PG
  Bottom 0.254: R7.1 18.81,37.54 IC1.5
PROG
  Bottom 0.381: R4.2 19.37,21.31 U1.5
PROTECTION_NRST
  Bottom 0.254: R8.2 25.54,41.45 U3.2
RX  (via drill 0.35, 1)
  Top 0.254: v22.86,46.74 22.86,48.26 15.24,55.88 v15.24,56.26
  Bottom 0.203: v22.86,46.74 22.86,46.1 24.32,44.63 30.27,44.63 31.12,45.48 v31.12,49.28
  Bottom 0.254: J3.D03 17.8,78.13 4.15,78.13 1.92,75.9 1.92,69.64 4.48,67.08 10.1,67.08 12.85,64.33 12.85,61.84 12.71,61.7 12.71,57.84 12.46,57.58 12.46,57.04 13.24,56.26 v15.24,56.26 16.13,56.26 16.15,56.28 16.28,56.42 U0.9
STAT  (via drill 0.35)
  Top 0.254: v19.82,47.4 16.87,47.4 14.95,49.31 11.7,49.31 v11.68,49.3 | v26.44,46.48 26.44,45.49 26.19,45.24 26.19,31.78 21.57,27.16 v21.57,23.03
  Bottom 0.254: v11.68,49.3 10.91,50.08 10.91,53.53 12.35,54.97 18.01,54.97 18.31,55.27 U0.7 | v26.44,46.48 25.42,47.5 21.59,47.5 21.21,47.12 20.09,47.12 v19.82,47.4
  Bottom 0.381: U1.1 v21.57,23.03 R3.1
SWCLK  (via drill 0.35, 1)
  Top 0.203: v28.58,51.82 28.58,51.94 30.11,53.48 30.11,54.77 30.7,55.36 31,55.36 32.13,56.49 32.13,57.53 31.75,57.91 28.18,57.91 24.49,61.6 v21.46,61.6
  Bottom 0.203: U0.24 21.31,61.44 v21.46,61.6 23.32,63.45 J3.A01
SWDIO  (via drill 0.35, 1)
  Top 0.203: v28.58,49.28 29.58,50.28 29.58,51.7 30.34,52.46 30.47,52.59 31.23,53.35 31.53,53.35 32.49,54.31 32.49,57.68 31.75,58.42 28.17,58.42 24.23,62.36 v20.94,62.36
  Bottom 0.203: U0.23 20.81,62.36 20.83,62.36 | v20.94,62.36 20.83,62.36 | 20.83,62.36 21.34,62.87 21.34,70.6
  Bottom 0.254: J3.A02 21.34,70.6
SWITCH_IN  (via drill 0.35)
  Top 0.254: v15.24,43.43 16.51,43.43 18.29,43.43 19.3,42.42 R9.2
  Bottom 0.254: v15.24,43.43 13.08,43.43 J1.2
  other vias: 19.3,42.48
SWO  (via drill 1)
  other vias: 31.12,54.36
TX  (via drill 0.35, 1)
  Top 0.203: v31.12,51.82 30.11,50.81 30.11,45.6 v29.97,45.47
  Top 0.254: v16.42,55.63 23.62,48.43 v23.62,46.23
  Bottom 0.203: v23.62,46.23 24.86,44.99 29.49,44.99 v29.97,45.47
  Bottom 0.254: J3.D02 19.39,78.54 3.98,78.54 1.51,76.07 1.51,69.47 4.31,66.68 9.93,66.68 12.45,64.16 12.45,62.01 12.31,61.87 12.31,58.01 12.05,57.75 12.05,56.87 13.32,55.6 16.26,55.6 16.4,55.6 | U0.8 17.81,55.6 16.51,55.6 16.4,55.6 | v16.42,55.63 16.4,55.6
VAUX
  Bottom 0.254: C9.1 20.61,35.27 19.93,34.59 IC1.6
VBAT  (via drill 0.35, 0.8)
  Top 0.254: v13.39,48.57 13.39,43.48 J1.1
  Top 0.508: v23.62,37.08 23.62,33.02 19.05,33.02 15.88,36.2 12.32,39.75 11.94,40.13 J1.1
  Bottom 0.254: IC1.2 17.03,40.46 C7.1 | C7.1 17.19,40.51 17.19,42.31 R10.2 | C7.1 16,40.51 13.46,40.51 J1.1 | R1.2 14.99,50.17 v13.39,48.57
  Bottom 0.381: C6.1 U1.3
  Bottom 0.508: U3.3 24.51,36.83 | 24.51,36.83 24.51,34.93 24.53,34.91 J4.2 | 24.51,36.83 24.26,37.08 v23.62,37.08
  Bottom 1.016: J4.2 28.08,34.91 28.96,34.04 28.96,32.26 28.45,31.75 28.45,27.38 J0.1 27.18,25.2 27.18,23.11 v27.18,19.81 26.48,19.12 C6.1 25.4,9.91 J5.P03_4 | J5.P03_4 J5.P03_1 J5.P03_2 J5.P03_3 | J5.P03_6 J5.P03_5 J5.P03_4
  pour Bottom (no thermals): 26.42,19.81 23.88,19.81 23.62,19.56 23.37,19.3 20.32,19.3 20.32,17.53 26.42,17.53
  pour Bottom (no thermals): 17.6,37.19 17.58,37.21 16.97,37.21 16.97,38.25 15.09,40.13 12.19,40.13 10.92,41.4 10.92,42.42 11.43,42.93 17.65,42.93 17.65,37.24
  pour Top (no thermals): 24.64,38.1 24.64,32.51 23.88,31.75 18.8,31.75 10.92,39.62 10.92,42.42 11.43,42.93 12.45,42.93 12.95,42.42 12.95,40.13 19.56,33.53 21.97,33.53 22.61,34.16 22.61,38.1
  pour Bottom (no thermals): 29.39,34.29 25.07,38.61 23.88,38.61 22.86,37.59 22.86,34.8 23.62,34.04 27.94,34.04 28.45,33.53 28.45,32.26 29.39,32.26
  pour Bottom (no thermals): 26.67,4.32 26.67,10.41 26.16,10.92 23.37,10.92 22.86,10.41 22.86,4.32 23.37,3.81 26.16,3.81
VDDA
  Bottom 0.254: U0.5 C4.1 | C3.1 C4.1 | C4.1 21.36,52.64 FB0.2
  pour Bottom (no thermals): 22.48,53.34 21.21,54.61 19.81,54.61 19.3,55.12 18.29,54.1 17.53,54.1 16.76,53.34 16.76,51.94 22.48,51.94
VUSB
  Bottom 0.305: 15.37,25.02 15.21,25.02 15.21,17.81
  Bottom 0.381: J2.1 13.39,25.75 13.46,25.82 14.56,25.82 15.37,25.02 LED1.A | U1.4 C5.1
  Bottom 1.016: C5.1 15.21,17.81 14.94,17.54 J5.P02_1 | J5.P02_1 J5.P02_2 J5.P02_3 | J5.P02_1 J5.P02_4 J5.P02_5 J5.P02_6
  pour Bottom (no thermals): 14.22,25.65 14.73,25.15 14.73,18.29 15.49,17.53 19.81,17.53 19.81,19.3 15.49,19.3 15.49,23.37 16.76,24.64 16.76,25.4 14.99,25.4 14.73,25.65
  pour Bottom (no thermals): 13.97,4.32 13.97,10.41 14.48,10.92 17.27,10.92 17.78,10.41 17.78,4.32 17.27,3.81 14.48,3.81

### Text on the board
tPlace: 3V3 | GND | SDA | SCL | !RESET! | SWDIO | SWCLK | SWO | NRST | BUTTON | ADC | TX | RX
tNames: SDA | GND | SCL | 3V3